# Altium schematic sheet Sheet3.SchDoc
size 594 x 420 mm; SheetNumber: 2; SheetTotal: 4; PageSetup: Record=PageOptions|CenterHorizontal=True|CenterVertical=True|PrintScale=0.94|XCorrection=1.00|YCorrection=1.00|PrintKind=1|BorderSize=5000000|LeftOffset=0|BottomOffset=0|Orientation=1|PaperLength=1000|PaperWidth=1000|Scale=100|PaperSource=7|PrintQuality=-4|MediaType=1|DitherType=10|PaperKind=A4|PrintScaleMode=1; DecimalNumber: Децимальный номер; HeadOfSector: Нач. сектора; MainDevice: Перв.примен.; Name1: Наименование1; lit_A: О; n_kontr: Н. Контр; t_kontr: Т. Контр; Name2: Наименование2
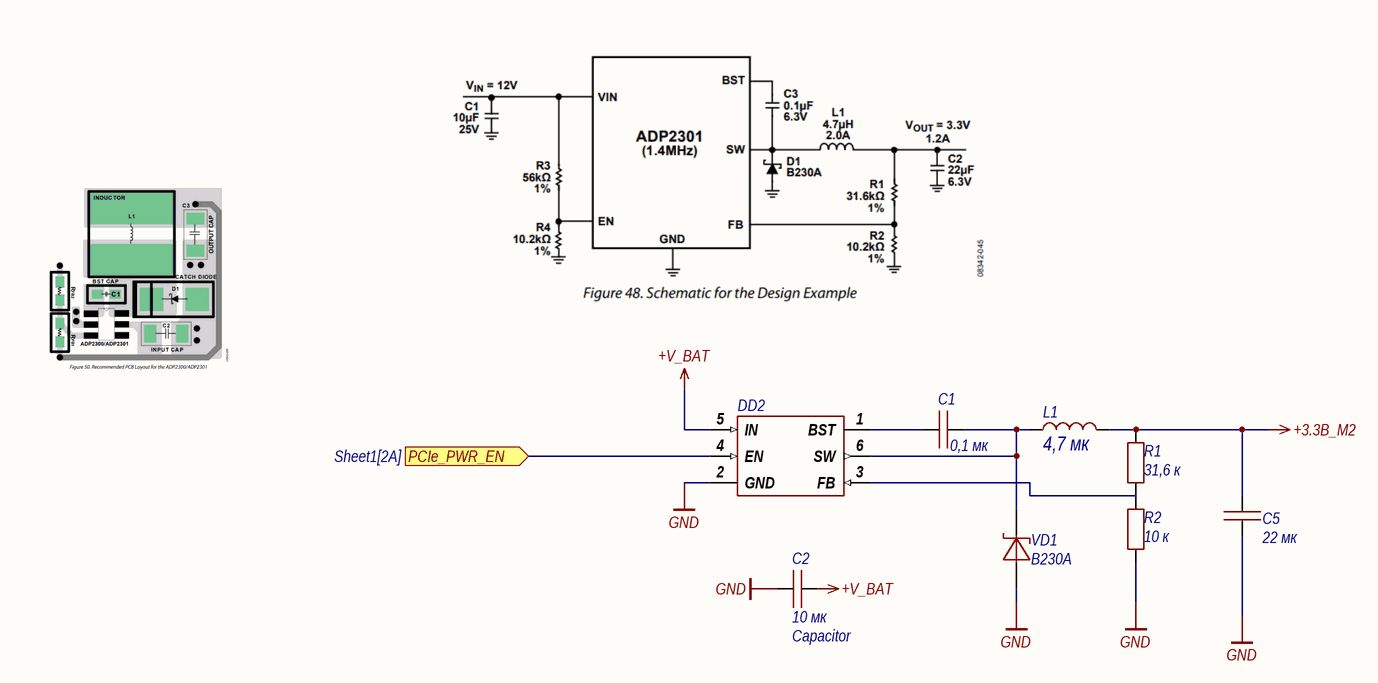
[diagram p0: Sheet3.SchDoc]

## Parts
C1  value 0,1 мк  [0603C]  (hidden comment: Capacitor)
C2  Capacitor  value 10 мк  [1210C]
C5  value 22 мк  [1210C]  (hidden comment: Capacitor)
DD2  Повышающий DC-DC преобразователь 2А 1.2МГц  (value not drawn)
L1  value 4,7 мк  [IHLP-2525]  (hidden comment: IHLP2525CZER4R7M01)
R1  value 31,6 к  [0603R]  (hidden comment: Resistor)
R2  value 10 к  [0603R]  (hidden comment: Resistor)
VD1  B230A  [SMA]

## Ports
PCIe_PWR_EN (in, see Sheet1[2A])

## Nets
+3.3В_M2: C5.2 L1.2 R1.1
+V_BAT: C2.2 DD2.5(IN)
GND: C2.1 C5.1 DD2.2(GND) R2.1 VD1.1
PCIe_PWR_EN: DD2.4(EN) ; port PCIe_PWR_EN
NetC1_1: C1.1 DD2.1(BST)
NetC1_2: C1.2 DD2.6(SW) L1.1 VD1.2
NetDD2_3: DD2.3(FB) R1.2 R2.2

## Notes on the sheet
- Перв.примен.
- Справ.№
- Подп. и дата
- Инв.№ дубл.
- Взам.инв.№
- Подп.и дата
- Разраб.
- Изм.
- Лист
- № докум.
- Подп.
- Дата
- Лит.
- Масштаб
- Масса
- Т. контр
- Пров.
- Схема электрическая принципиальная
- Листов
- Инв.№ подл.
- Утв.
- Н.контр.
- Формат  A2

## Library data of the parts
C1 = Capacitor_0,1u_10_50V_X7R_0603C: Конденсатор; Library Path2: Schematic\Capacitor.SchLib; Tolerance: 0,1; Voltage (V): 50; Dielectric: X7R; Capacity (nF): 100; Part Number: Capacitor_0,1u_10_50V_X7R_0603C
C2 = Capacitor_10u_10_35V_X7R_1210C: Конденсатор; Library Path2: Schematic\Capacitor.SchLib; Tolerance: 0,1; Voltage (V): 35; Dielectric: X7R; Capacity (nF): 10000; Part Number: Capacitor_10u_10_35V_X7R_1210C
C5 = Capacitor_22u_10_25V_X7R_1210C: Конденсатор; Library Path2: Schematic\Capacitor.SchLib; Tolerance: 0,1; Voltage (V): 25; Dielectric: X7R; Capacity (nF): 22000; Part Number: Capacitor_22u_10_25V_X7R_1210C
DD2 = ADP2300
L1 = IHLP2525CZER4R7M01: ЧИП-индуктивность экранированная 4,7мкГн ±20% 5,5A 40мОм 2525; Inductance (μH): 4,7; Current (A): 5,5; Part Number: IHLP2525CZER4R7M01
R1 = Resistor_31.6k_1_0603: Резистор номиналом 31,6 кОм и точностью 1%; Power: *; Part Number: Resistor_31.6k_1_0603; Tolerance: 1%
R2 = Resistor_10k_1_0603: Резистор номиналом 10 кОм и точностью 1%; Power: *; Part Number: Resistor_10k_1_0603; Tolerance: 1%
VD1 = 15MQ040N: Диод шоттки на 40 В, ном. ток 2.1 А; Voltage nominal (V): 40; Current (A): 2.1; Part Number: 15MQ040N